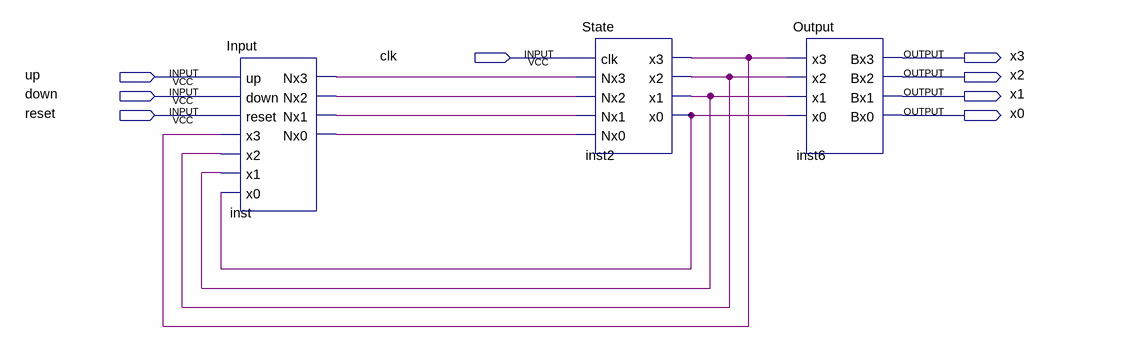
[diagram p0: schematic sheet]
// Quartus schematic Moore.bdf as structural Verilog: 3 symbols, 8 pins
module Moore (
  input  clk,
  input  up,
  input  down,
  input  reset,
  output x3,
  output x2,
  output x1,
  output x0
);

  wire inst2_x0, inst2_x1, inst2_x2, inst2_x3, inst_nx0, inst_nx1, inst_nx2, inst_nx3;

  Input inst (
    .up(up), .down(down), .reset(reset), .x3(inst2_x3), .x2(inst2_x2), .x1(inst2_x1), .x0(inst2_x0),
    .Nx3(inst_nx3), .Nx2(inst_nx2), .Nx1(inst_nx1), .Nx0(inst_nx0));
  State inst2 (
    .clk(clk), .Nx3(inst_nx3), .Nx2(inst_nx2), .Nx1(inst_nx1), .Nx0(inst_nx0), .x3(inst2_x3), .x2(inst2_x2),
    .x1(inst2_x1), .x0(inst2_x0));
  Output inst6 (.x3(inst2_x3), .x2(inst2_x2), .x1(inst2_x1), .x0(inst2_x0), .Bx3(x3), .Bx2(x2), .Bx1(x1), .Bx0(x0));
endmodule
